# Altium schematic sheet motor hat.SchDoc: Wprowadź Tytuł
size A4; CheckedBy: Wprowadź sprawdzającego; DrawnBy: Wprowadź autora; Organization: Koło Naukowe Robotyków; Address1: Nowowiejska 24; Address2: 00-001; Address3: Wraszawa; Address4: Polska; Revision: Numer; Nazwa Arkusza: Wpisz nazwę arkusza; ProjectName: Nazwa Projektu
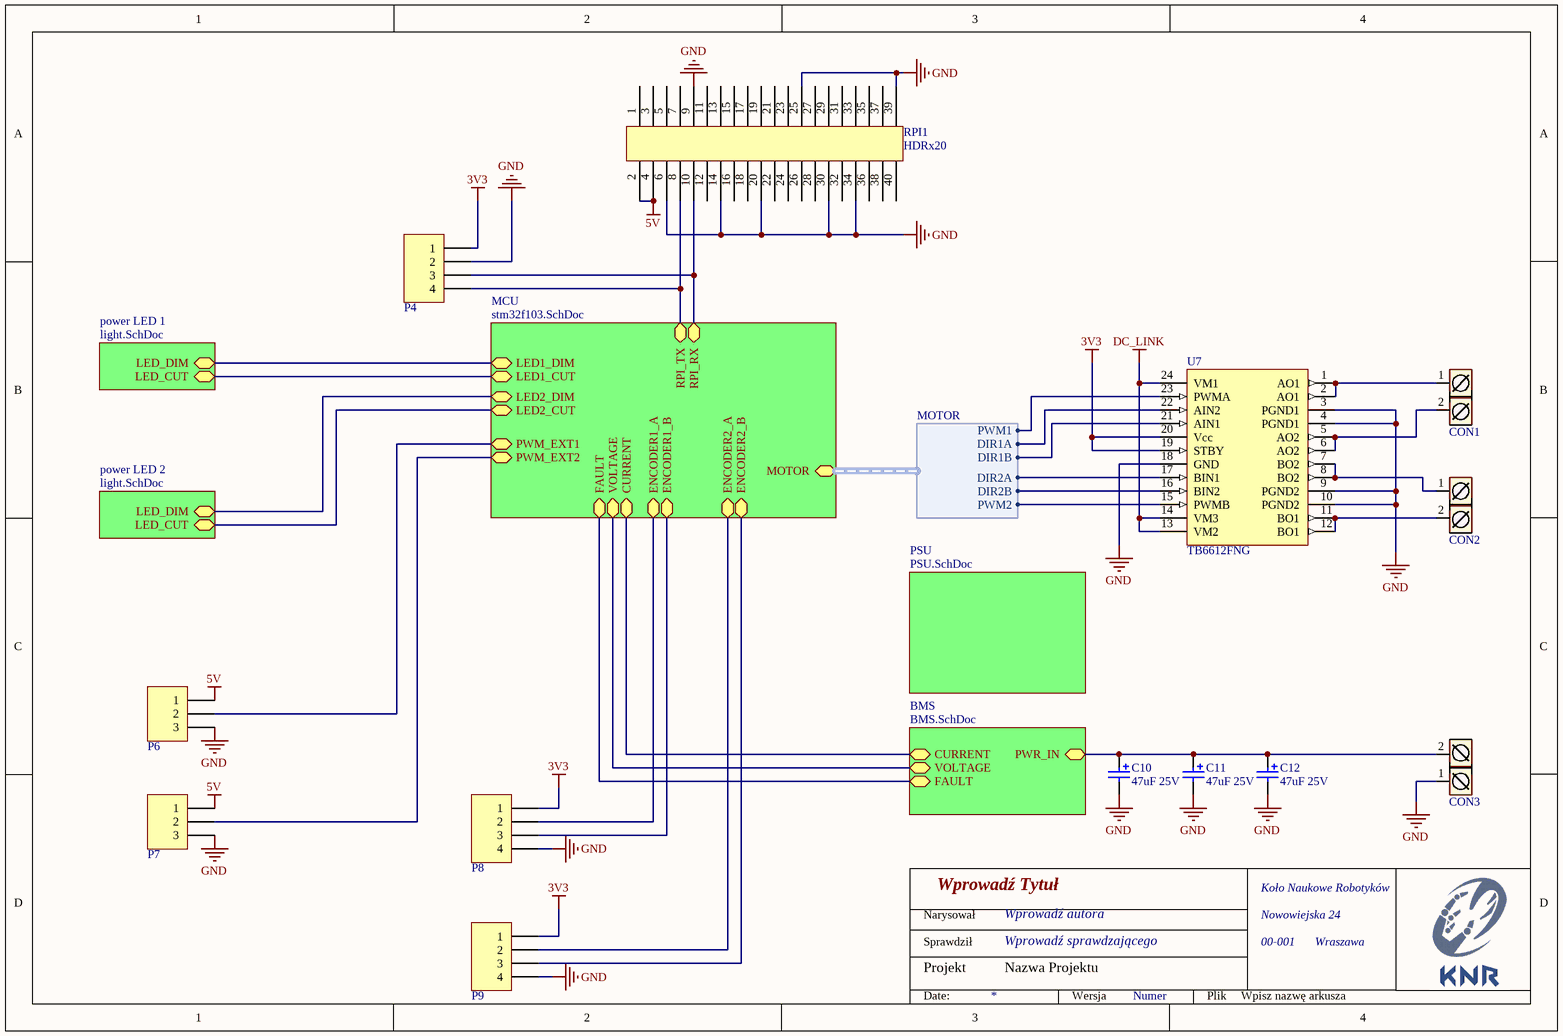
[diagram p0: motor hat.SchDoc]

## Parts
C10  47uF 25V  [ELECTROLYTIC 5mm]
C11  47uF 25V  [ELECTROLYTIC 5mm]
C12  47uF 25V  [ELECTROLYTIC 5mm]
CON1  ARK2  [ARK2]  (value not drawn)
CON2  ARK2  [ARK2]  (value not drawn)
CON3  ARK2  [ARK2]  (value not drawn)
P4  HDR1X4  [HDR1X4]  (value not drawn)
P6  HDR1X3  [HDR1X3]  (value not drawn)
P7  HDR1X3  [HDR1X3]  (value not drawn)
P8  HDR1X4  [HDR1X4]  (value not drawn)
P9  HDR1X4  [HDR1X4]  (value not drawn)
RPI1  HDRx20  [HDR2x20]
U7  TB6612FNG  [SSOP24-P-300]

## Sub-sheets
BMS = BMS.SchDoc: PWR_IN, CURRENT, VOLTAGE, FAULT
MCU = stm32f103.SchDoc: LED1_DIM, LED2_DIM, LED2_CUT, LED1_CUT, PWM_EXT1, PWM_EXT2, CURRENT, VOLTAGE, FAULT, ENCODER1_A, ENCODER1_B, ENCODER2_A, ENCODER2_B, RPI_TX, RPI_RX, MOTOR (harness MOTOR)
power LED 1 = light.SchDoc: LED_CUT, LED_DIM
power LED 2 = light.SchDoc: LED_CUT, LED_DIM
PSU = PSU.SchDoc: no entries

## Harnesses
MOTOR: DIR2B, DIR2A, PWM2, PWM1, DIR1B, DIR1A

## Nets
3V3: P4.1 P8.1 P9.1 U7.19(STBY) U7.20(Vcc)
5V: P6.1 P7.1 RPI1.2 RPI1.4
DC_LINK: U7.13(VM2) U7.14(VM3) U7.24(VM1)
GND: C10.2 C11.2 C12.2 CON3.1 P4.2 P6.3 P7.3 P8.4 P9.4 RPI1.6 RPI1.9 RPI1.14 RPI1.20 RPI1.25 RPI1.30 RPI1.34 RPI1.39 U7.3(PGND1) U7.4(PGND1) U7.9(PGND2) U7.10(PGND2) U7.18(GND)
NetC10_1: C10.1 C11.1 C12.1 CON3.2 ; sheet BMS/PWR_IN
NetCON1_1: CON1.1 U7.1(AO1) U7.2(AO1)
NetCON1_2: CON1.2 U7.5(AO2) U7.6(AO2)
NetCON2_1: CON2.1 U7.7(BO2) U7.8(BO2)
NetCON2_2: CON2.2 U7.11(BO1) U7.12(BO1)
NetP4_3: P4.3 RPI1.10 ; sheet MCU/RPI_RX
NetP4_4: P4.4 RPI1.8 ; sheet MCU/RPI_TX
NetP6_2: P6.2 ; sheet MCU/PWM_EXT1
NetP7_2: P7.2 ; sheet MCU/PWM_EXT2
NetP8_2: P8.2 ; sheet MCU/ENCODER1_A
NetP8_3: P8.3 ; sheet MCU/ENCODER1_B
NetP9_2: P9.2 ; sheet MCU/ENCODER2_A
NetP9_3: P9.3 ; sheet MCU/ENCODER2_B
NetU7_15: U7.15(PWMB) ; sheet MCU/MOTOR.PWM2
NetU7_16: U7.16(BIN2) ; sheet MCU/MOTOR.DIR2B
NetU7_17: U7.17(BIN1) ; sheet MCU/MOTOR.DIR2A
NetU7_21: U7.21(AIN1) ; sheet MCU/MOTOR.DIR1B
NetU7_22: U7.22(AIN2) ; sheet MCU/MOTOR.DIR1A
NetU7_23: U7.23(PWMA) ; sheet MCU/MOTOR.PWM1
(unnamed): sheet MCU/LED1_DIM, sheet power LED 1/LED_DIM
(unnamed): sheet MCU/LED2_DIM, sheet power LED 2/LED_DIM
(unnamed): sheet MCU/LED2_CUT, sheet power LED 2/LED_CUT
(unnamed): sheet MCU/LED1_CUT, sheet power LED 1/LED_CUT
(unnamed): sheet MCU/CURRENT, sheet BMS/CURRENT
(unnamed): sheet MCU/VOLTAGE, sheet BMS/VOLTAGE
(unnamed): sheet MCU/FAULT, sheet BMS/FAULT

Not connected (* = marked no-connect by the designer): RPI1 1 3 5 7 11 12 13 15 16 17 18 19 21 22 23 24 26 27 28 29 31 32 33 35 36 37 38 40

## Notes on the sheet
- Narysował
- Sprawdził
- Projekt
- Date:
- Wersja
- Plik

## Library data of the parts
C10-C12 = Electrolytic: Electrolytic capacitor; Value: 47uF 25V
CON1-CON3 = ARK2: Złącze śrubowe 2 piny
P4 P8 P9 = HDR1X4: Header, 4-Pin; LatestRevisionDate: 17-Jul-2002; LatestRevisionNote: Re-released for DXP Platform.; Publisher: Altium Limited
P6 P7 = HDR1X3: Header, 3-Pin; LatestRevisionDate: 17-Jul-2002; LatestRevisionNote: Re-released for DXP Platform.; Publisher: Altium Limited
U7 = TB6612FNG: Driver IC for Dual DC motor